# Altium schematic sheet Power_.SchDoc
size 381 x 241 mm
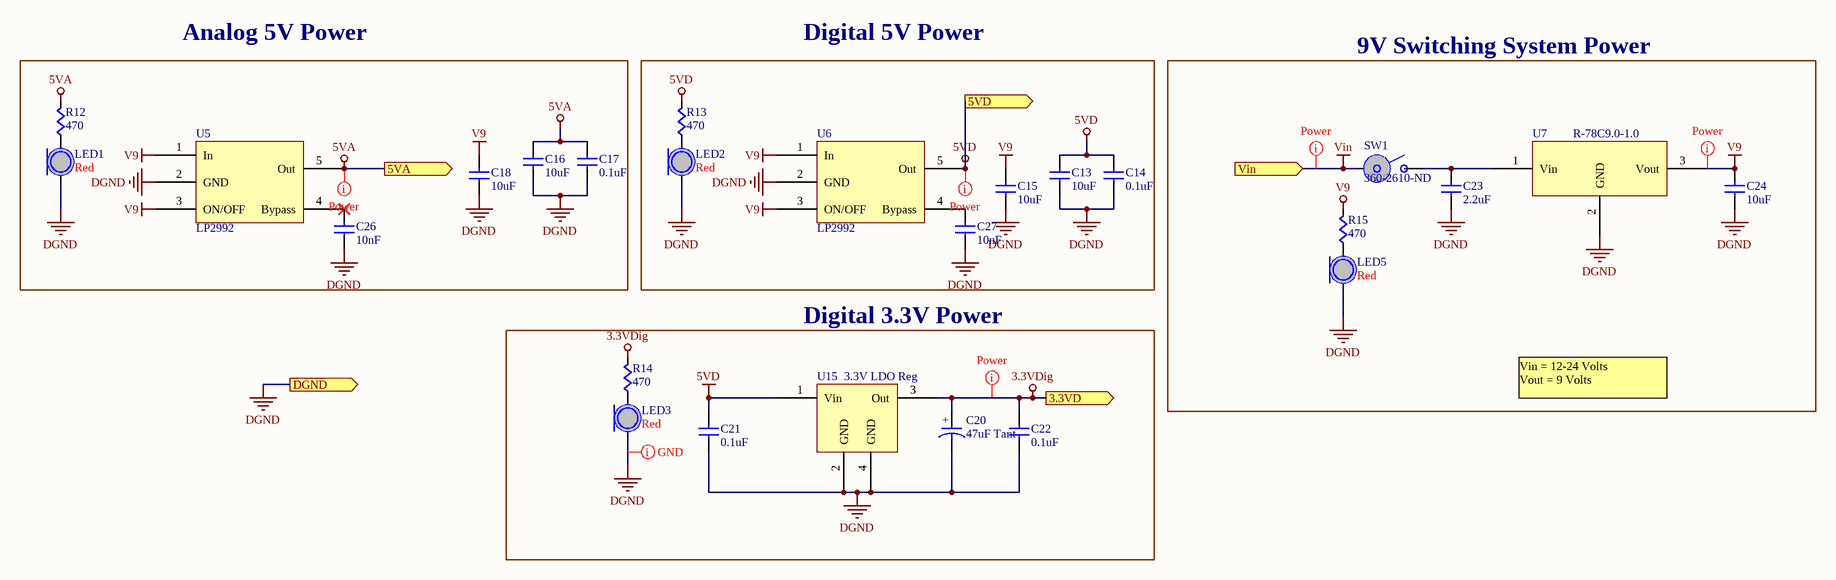
[diagram p0: Power_.SchDoc]

## Parts
C13  value 10uF  [CAPC0603]  (hidden comment: Cap)
C14  value 0.1uF  [CAPC0603]  (hidden comment: Cap)
C15  value 10uF  [CAPC0603]  (hidden comment: Cap)
C16  value 10uF  [CAPC0603]  (hidden comment: Cap)
C17  value 0.1uF  [CAPC0603]  (hidden comment: Cap)
C18  value 10uF  [CAPC0603]  (hidden comment: Cap)
C20  value 47uF Tant  [1206]  (hidden comment: Cap Tant)
C21  value 0.1uF  [CAPC0603]  (hidden comment: Cap)
C22  value 0.1uF  [CAPC0603]  (hidden comment: Cap)
C23  value 2.2uF  [CAPC0603]  (hidden comment: Cap)
C24  value 10uF  [CAPC0603]  (hidden comment: Cap)
C26  value 10nF  [CAPC0603]  (hidden comment: Cap)
C27  value 10nF  [CAPC0603]  (hidden comment: Cap)
LED1  Color: Red  [LED0805]  (hidden comment: LED)
LED2  Color: Red  [LED0805]  (hidden comment: LED)
LED3  Color: Red  [LED0805]  (hidden comment: LED)
LED5  Color: Red  [LED0805]  (hidden comment: LED)
R12  value 470  [RES0603]  (hidden comment: Res)
R13  value 470  [RES0603]  (hidden comment: Res)
R14  value 470  [RES0603]  (hidden comment: Res)
R15  value 470  [RES0603]  (hidden comment: Res)
SW1  360-2610-ND  [AS11CP]
U5  LP2992  [SOT23-5]
U6  LP2992  [SOT23-5]
U7  R-78C9.0-1.0  [R-78C12-1.0]
U15  3.3V LDO Reg  [SOT23-4n]

## Blocks framed on the sheet
Analog 5V Power: C16-C18 C26 LED1 R12 U5
Digital 5V Power: C13-C15 C27 LED2 R13 U6
9V Switching System Power: C23 C24 LED5 R15 SW1 U7
Digital 3.3V Power: C20-C22 LED3 R14 U15

## Ports
3.3VD (out), 5VA (out), 5VD (out), DGND (out), Vin (in)

## Nets
3.3VDig: C20.1(A) C22.1(A) R14.1(A) U15.3(Out) ; port 3.3VD
5VA: C16.1(A) C17.1(A) R12.1(A) U5.5(Out) ; port 5VA
5VD: C13.1(A) C14.1(A) C21.1(A) R13.1(A) U6.5(Out) U15.1(Vin) ; port 5VD
DGND: C13.2(B) C14.2(B) C15.2(B) C16.2(B) C17.2(B) C18.2(B) C20.2(B) C21.2(B) C22.2(B) C23.2(B) C24.2(B) C26.2(B) C27.2(B) LED1.C LED2.C LED3.C LED5.C U5.2(GND) U6.2(GND) U7.2(GND) U15.2(GND) U15.4(GND) ; port DGND
V9: C15.1(A) C18.1(A) C24.1(A) R15.1(A) U5.1(In) U5.3(ON/OFF) U6.1(In) U6.3(ON/OFF) U7.3(Vout)
Vin: SW1.1(A) ; port Vin
NetC23_1: C23.1(A) SW1.2(B) U7.1(Vin)
NetC26_1: C26.1(A) U5.4(Bypass)
NetC27_1: C27.1(A) U6.4(Bypass)
NetLED1_A: LED1.A R12.2(B)
NetLED2_A: LED2.A R13.2(B)
NetLED3_A: LED3.A R14.2(B)
NetLED5_A: LED5.A R15.2(B)

## Layout directives
net class Power: 3.3VDig, 5VA, 5VD, V9, Vin
net class Ground: DGND

## Notes on the sheet
- Vin = 12-24 Volts
  Vout = 9 Volts
- (in symbol CapPol) +

## Library data of the parts
C20 = CapPol: CAP TANT 47UF 10V 10% 1411; Supplier 1: Digi-Key; Supplier Part Number 1: 399-9728-1-ND
SW1 = AS11CP: SWITCH SLIDE SPST 0.4VA 28V; Supplier 1: Digi-Key; Supplier Part Number 1: 360-2610-ND
U5 U6 = LP2992: IC REG LDO 5V 0.25A SOT23-5; Supplier 1: Digi-Key; Supplier Part Number 1: LP2992IM5-5.0/NOPBCT-ND
U7 = R-78C9-1.0: 945-1396-5-ND; Supplier 1: Digi-Key; Supplier Part Number 1: 945-1396-5-ND
U15 = LM3940IMPX-3.3: IC REG LDO 3.3V 1A SOT223; Supplier 1: Digi-Key; Supplier Part Number 1: LM3940IMPX-3.3/NOPBCT-ND
C13-C18 C21-C24 C26 C27 = Cap: Supplier 1: Digi-Key; Supplier Part Number 1: 1276-1000-1-ND
LED1-LED3 LED5 = LED: Supplier 1: Digi-Key; Supplier Part Number 1: 754-1122-1-ND
R12-R15 = Res: Supplier 1: Digi-Key; Supplier Part Number 1: RMCF0603JT10K0CT-ND